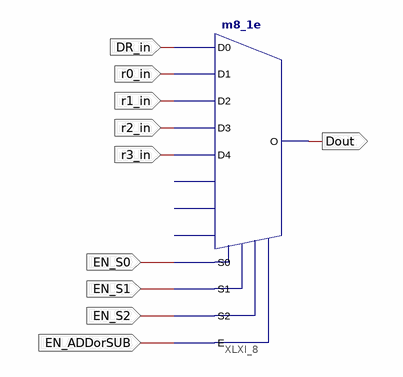
[diagram p0: schematic sheet 1]
// Xilinx ISE schematic MUX5_1.sch (spartan3e) as structural Verilog: 1 symbols, 10 ports
module MUX5_1 (
  input  EN_ADDorSUB,
  input  EN_S0,
  input  EN_S1,
  input  EN_S2,
  input  DR_in,
  input  r0_in,
  input  r1_in,
  input  r2_in,
  input  r3_in,
  output Dout
);

  m8_1e XLXI_8 (
    .D0(DR_in), .D1(r0_in), .D2(r1_in), .D3(r2_in), .D4(r3_in), .E(EN_ADDorSUB), .S0(EN_S0), .S1(EN_S1),
    .S2(EN_S2), .O(Dout));  // open: D5, D6, D7
endmodule
